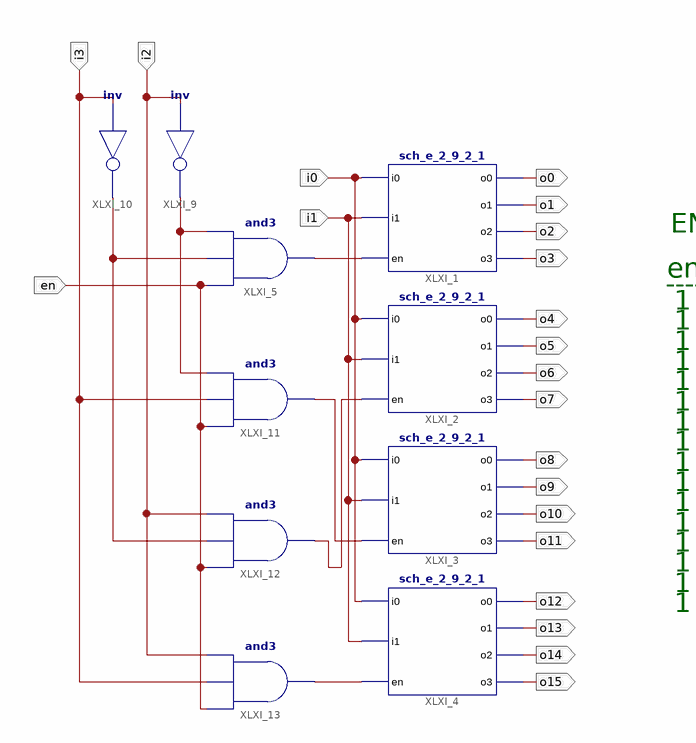
[diagram p0: schematic sheet 1]
// Xilinx ISE schematic sch_e_2_9_2_7.sch (spartan3e) as structural Verilog: 10 symbols, 21 ports
module sch_e_2_9_2_7 (
  input  i0,
  input  i1,
  input  i3,
  input  i2,
  input  en,
  output o0,
  output o1,
  output o2,
  output o3,
  output o4,
  output o5,
  output o6,
  output o7,
  output o8,
  output o9,
  output o10,
  output o11,
  output o12,
  output o13,
  output o14,
  output o15
);

  wire XLXN_8, XLXN_11, XLXN_18, XLXN_19, XLXN_52, XLXN_53;

  sch_e_2_9_2_1 XLXI_1 (.i0(i0), .i1(i1), .en(XLXN_8), .o0(o0), .o1(o1), .o2(o2), .o3(o3));
  sch_e_2_9_2_1 XLXI_2 (.i0(i0), .i1(i1), .en(XLXN_53), .o0(o4), .o1(o5), .o2(o6), .o3(o7));
  sch_e_2_9_2_1 XLXI_3 (.i0(i0), .i1(i1), .en(XLXN_52), .o0(o8), .o1(o9), .o2(o10), .o3(o11));
  sch_e_2_9_2_1 XLXI_4 (.i0(i0), .i1(i1), .en(XLXN_11), .o0(o12), .o1(o13), .o2(o14), .o3(o15));
  and XLXI_5 (XLXN_8, en, XLXN_19, XLXN_18);
  not XLXI_9 (XLXN_18, i2);
  not XLXI_10 (XLXN_19, i3);
  and XLXI_11 (XLXN_52, en, i3, XLXN_18);
  and XLXI_12 (XLXN_53, en, XLXN_19, i2);
  and XLXI_13 (XLXN_11, en, i3, i2);

  // Notes on the sheet:
  //   EN DECODER 4-16
  //   en    i                o
  //   -------------------------
  //   1 0000 0000000000000001
  //   1 0001 0000000000000010
  //   1 0010 0000000000000100
  //   1 0011 0000000000001000
  //   1 0100 0000000000010000
  //   1 0101 0000000000100000
  //   1 0110 0000000001000000
  //   1 0111 0000000010000000
  //   1 1000 0000000100000000
  //   1 1001 0000001000000000
  //   1 1010 0000010000000000
  //   1 1011 0000100000000000
  //   1 1100 0001000000000000
  //   1 1101 0010000000000000
  //   1 1110 0100000000000000
  //   1 1111 1000000000000000
endmodule
